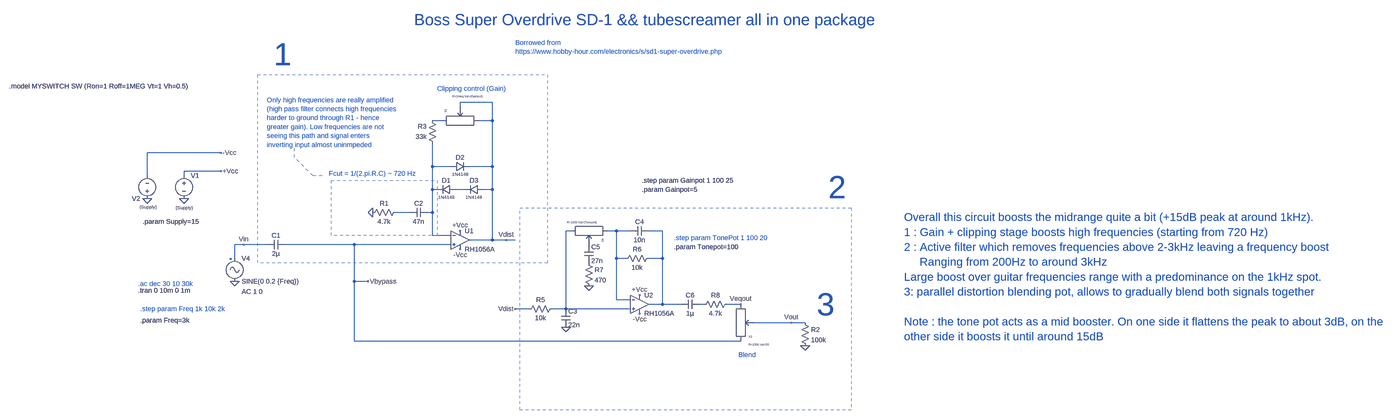
[diagram p0: schematic BossSuperOverdrive-SD-1.asc, whole sheet]
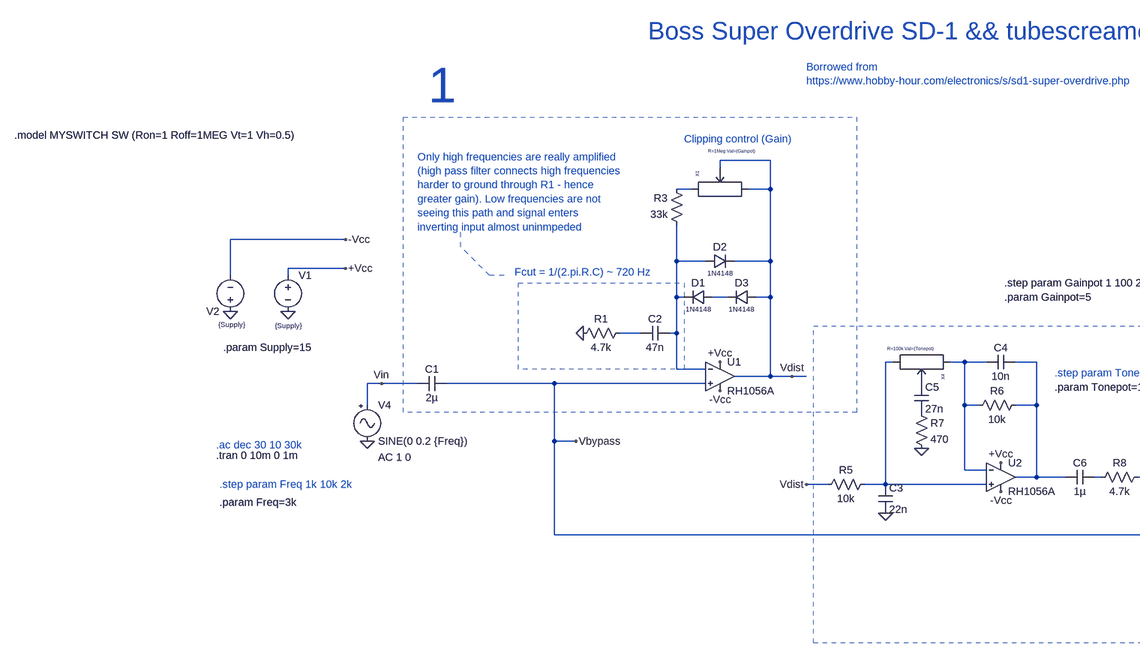
[diagram p1: schematic BossSuperOverdrive-SD-1.asc, part, row 1 of 1, column 1 of 2]
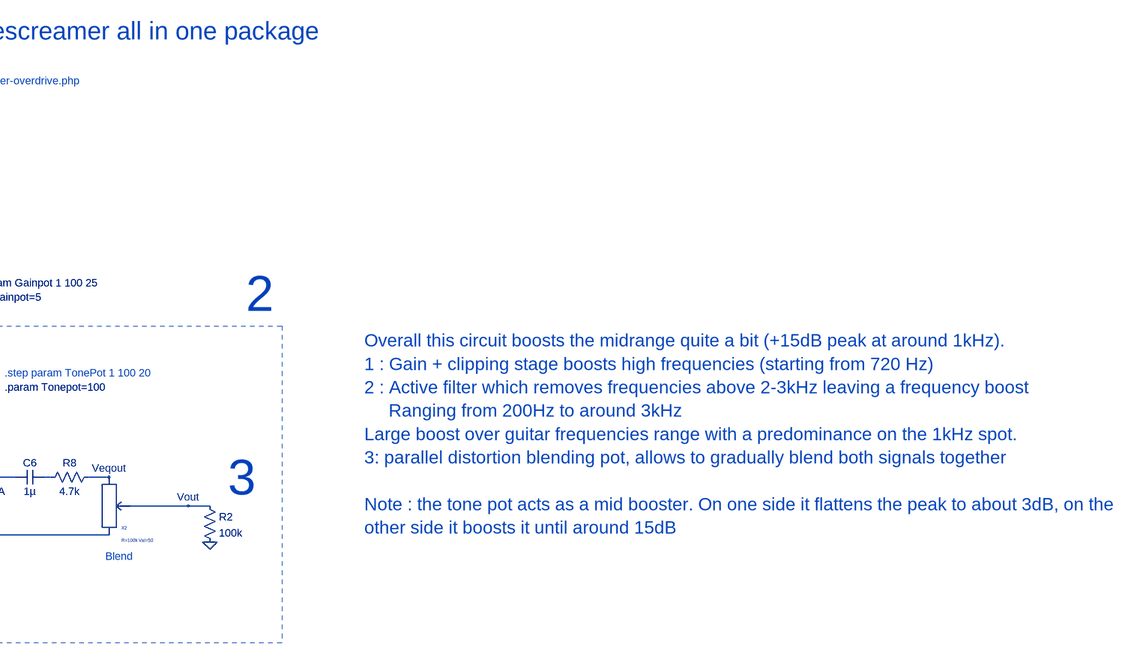
[diagram p2: schematic BossSuperOverdrive-SD-1.asc, part, row 1 of 1, column 2 of 2]
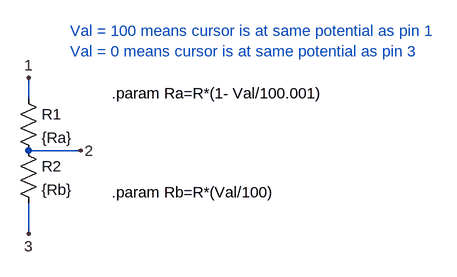
[diagram p3: sub-circuit potentiometer.asc]
BossSuperOverdrive-SD-1.asc, the LTspice schematic file:
Version 4
SHEET 1 4652 756
WIRE 640 -320 528 -320
WIRE 528 -304 528 -320
WIRE 464 -256 432 -256
WIRE 640 -256 640 -320
WIRE 640 -256 592 -256
WIRE -304 -144 -560 -144
WIRE 432 -96 432 -176
WIRE 496 -96 432 -96
WIRE 640 -96 640 -256
WIRE 640 -96 560 -96
WIRE -304 -80 -432 -80
WIRE -560 -64 -560 -144
WIRE -432 -64 -432 -80
WIRE 432 -16 432 -96
WIRE 448 -16 432 -16
WIRE 544 -16 512 -16
WIRE 640 -16 640 -96
WIRE 640 -16 608 -16
WIRE 352 64 304 64
WIRE 432 64 432 -16
WIRE 432 64 416 64
WIRE 912 128 896 128
WIRE 1072 128 1040 128
WIRE 1120 128 1072 128
WIRE 1232 128 1184 128
WIRE 432 144 432 64
WIRE 496 144 432 144
WIRE 640 160 640 -16
WIRE 640 160 560 160
WIRE 688 160 640 160
WIRE 720 160 688 160
WIRE -224 176 -256 176
WIRE -144 176 -224 176
WIRE 160 176 -80 176
WIRE 496 176 160 176
WIRE -256 224 -256 176
WIRE 1072 224 1072 128
WIRE 1104 224 1072 224
WIRE 1232 224 1232 128
WIRE 1232 224 1184 224
WIRE 160 304 160 176
WIRE 208 304 160 304
WIRE 1072 368 1072 224
WIRE 1120 368 1072 368
WIRE 1232 384 1232 224
WIRE 1232 384 1184 384
WIRE 1296 384 1232 384
WIRE 1376 384 1360 384
WIRE 1504 384 1456 384
WIRE 768 400 720 400
WIRE 896 400 896 128
WIRE 896 400 848 400
WIRE 1120 400 896 400
WIRE 1680 448 1552 448
WIRE 1728 448 1680 448
WIRE 160 512 160 304
WIRE 1504 512 160 512
FLAG -560 16 0
FLAG -432 16 0
FLAG -304 -80 +Vcc
FLAG -304 -144 -Vcc
FLAG 528 128 +Vcc
FLAG 528 192 -Vcc
FLAG -256 304 0
FLAG 224 64 0
FLAG 1728 528 0
FLAG -224 176 Vin
FLAG 688 160 Vdist
FLAG 1680 448 Vout
FLAG 208 304 Vbypass
FLAG 896 464 0
FLAG 720 400 Vdist
FLAG 1152 352 +Vcc
FLAG 1152 416 -Vcc
FLAG 976 320 0
FLAG 1504 384 Veqout
SYMBOL cap -80 160 R90
WINDOW 0 0 32 VBottom 2
WINDOW 3 32 32 VTop 2
SYMATTR InstName C1
SYMATTR Value 2µ
SYMBOL voltage -432 -80 R0
WINDOW 123 0 0 Left 0
WINDOW 39 0 0 Left 0
WINDOW 3 -29 127 Left 1
SYMATTR Value {Supply}
SYMATTR InstName V1
SYMBOL voltage -560 32 R180
WINDOW 123 0 0 Left 0
WINDOW 39 0 0 Left 0
WINDOW 3 -33 -13 Left 1
SYMATTR Value {Supply}
SYMATTR InstName V2
SYMBOL diode 512 -32 R90
WINDOW 0 0 32 VBottom 2
WINDOW 3 32 32 VTop 1
SYMATTR InstName D1
SYMATTR Value 1N4148
SYMBOL diode 496 -80 R270
WINDOW 0 32 32 VTop 2
WINDOW 3 0 32 VBottom 1
SYMATTR InstName D2
SYMATTR Value 1N4148
SYMBOL Misc\\signal -256 208 R0
WINDOW 123 24 132 Left 2
WINDOW 39 0 0 Left 0
SYMATTR Value2 AC 1 0
SYMATTR InstName V4
SYMATTR Value SINE(0 0.2 {Freq})
SYMBOL OpAmps\\RH1056A 528 96 R0
SYMATTR InstName U1
SYMBOL diode 608 -32 R90
WINDOW 0 0 32 VBottom 2
WINDOW 3 32 32 VTop 1
SYMATTR InstName D3
SYMATTR Value 1N4148
SYMBOL res 320 48 R90
WINDOW 0 0 56 VBottom 2
WINDOW 3 32 56 VTop 2
SYMATTR InstName R1
SYMATTR Value 4.7k
SYMBOL res 1712 432 R0
SYMATTR InstName R2
SYMATTR Value 100k
SYMBOL res 448 -160 R180
WINDOW 0 36 76 Left 2
WINDOW 3 36 40 Left 2
SYMATTR InstName R3
SYMATTR Value 33k
SYMBOL cap 416 48 R90
WINDOW 0 0 32 VBottom 2
WINDOW 3 32 32 VTop 2
SYMATTR InstName C2
SYMATTR Value 47n
SYMBOL Potentiometer 528 -256 R270
WINDOW 39 84 -26 VRight 0
SYMATTR SpiceLine R=1Meg Val={Gainpot}
SYMATTR InstName X1
SYMBOL Potentiometer 1504 448 M180
WINDOW 39 28 -77 Left 0
SYMATTR SpiceLine R=100k Val=50
SYMATTR InstName X2
SYMBOL res 864 384 R90
WINDOW 0 0 56 VBottom 2
WINDOW 3 32 56 VTop 2
SYMATTR InstName R5
SYMATTR Value 10k
SYMBOL cap 880 400 R0
SYMATTR InstName C3
SYMATTR Value 22n
SYMBOL OpAmps\\RH1056A 1152 320 R0
SYMATTR InstName U2
SYMBOL res 1200 208 R90
WINDOW 0 0 56 VBottom 2
WINDOW 3 32 56 VTop 2
SYMATTR InstName R6
SYMATTR Value 10k
SYMBOL cap 1184 112 R90
WINDOW 0 0 32 VBottom 2
WINDOW 3 32 32 VTop 2
SYMATTR InstName C4
SYMATTR Value 10n
SYMBOL Potentiometer 976 128 R90
WINDOW 39 -29 -26 VRight 0
SYMATTR SpiceLine R=100k Val={Tonepot}
SYMATTR InstName X4
SYMBOL cap 960 176 R0
SYMATTR InstName C5
SYMATTR Value 27n
SYMBOL res 960 224 R0
SYMATTR InstName R7
SYMATTR Value 470
SYMBOL cap 1360 368 R90
WINDOW 0 0 32 VBottom 2
WINDOW 3 32 32 VTop 2
SYMATTR InstName C6
SYMATTR Value 1µ
SYMBOL res 1472 368 R90
WINDOW 0 0 56 VBottom 2
WINDOW 3 32 56 VTop 2
SYMATTR InstName R8
SYMATTR Value 4.7k
TEXT -592 336 Left 2 !.tran 0 10m 0 1m
TEXT -1040 -376 Left 2 !.model MYSWITCH SW (Ron=1 Roff=1MEG Vt=1 Vh=0.5)
TEXT -576 96 Left 2 !.param Supply=15
TEXT 1160 -48 Left 2 !.step param Gainpot 1 100 25
TEXT 1160 -16 Left 2 !.param Gainpot=5
TEXT 1496 560 Left 2 ;Blend
TEXT 448 -368 Left 2 ;Clipping control (Gain)
TEXT -584 400 Left 2 ;.step param Freq 1k 10k 2k
TEXT -584 440 Left 2 !.param Freq=3k
TEXT 720 -528 Left 2 ;Borrowed from \nhttps://www.hobby-hour.com/electronics/s/sd1-super-overdrive.php
TEXT 368 -608 Left 5 ;Boss Super Overdrive SD-1 && tubescreamer all in one package
TEXT -144 -328 Left 2 ;Only high frequencies are really amplified \n(high pass filter connects high frequencies\nharder to ground through R1 - hence \ngreater gain). Low frequencies are not\nseeing this path and signal enters \ninverting input almost uninmpeded
TEXT 72 -72 Left 2 ;Fcut = 1/(2.pi.R.C) ~ 720 Hz
TEXT -592 312 Left 2 ;.ac dec 30 10 30k
TEXT 1272 152 Left 2 ;.step param TonePot 1 100 20
TEXT 1272 184 Left 2 !.param Tonepot=100
TEXT -120 -488 Left 7 ;1
TEXT 1808 -24 Left 7 ;2
TEXT 2232 80 Left 4 ;Overall this circuit boosts the midrange quite a bit (+15dB peak at around 1kHz).\n1 : Gain + clipping stage boosts high frequencies (starting from 720 Hz)\n2 : Active filter which removes frequencies above 2-3kHz leaving a frequency boost \n     Ranging from 200Hz to around 3kHz\nLarge boost over guitar frequencies range with a predominance on the 1kHz spot.\n3: parallel distortion blending pot, allows to gradually blend both signals together\n \nNote : the tone pot acts as a mid booster. On one side it flattens the peak to about 3dB, on the \nother side it boosts it until around 15dB
TEXT 1768 384 Left 7 ;3
LINE Normal 192 -64 192 -64 2
LINE Normal 192 -64 192 -64 2
LINE Normal -48 -128 -48 -160 2
LINE Normal -32 -112 -48 -128 2
LINE Normal 16 -64 -32 -112 2
LINE Normal 48 -64 16 -64 2
LINE Normal 48 -64 48 -64 2
RECTANGLE Normal 448 144 80 -48 2
RECTANGLE Normal 832 240 -176 -416 2
RECTANGLE Normal 1888 752 736 48 2

potentiometer.asc, the sub-circuit schematic file:
Version 4
SHEET 1 908 680
WIRE 192 96 192 64
WIRE 272 176 192 176
WIRE 192 304 192 256
FLAG 192 64 1
FLAG 272 176 2
FLAG 192 304 3
SYMBOL res 176 80 R0
SYMATTR InstName R1
SYMATTR Value {Ra}
SYMBOL res 176 160 R0
SYMATTR InstName R2
SYMATTR Value {Rb}
TEXT 320 88 Left 2 !.param Ra=R*(1- Val/100.001)
TEXT 320 240 Left 2 !.param Rb=R*(Val/100)
TEXT 256 -8 Left 2 ;Val = 100 means cursor is at same potential as pin 1\nVal = 0 means cursor is at same potential as pin 3

The netlist it stands for:
* BossSuperOverdrive-SD-1.asc
C1 Vbypass Vin 2µ
V1 +Vcc 0 {Supply}
V2 0 -Vcc {Supply}
D1 N003 N002 1N4148
D2 N002 Vdist 1N4148
V4 Vin 0 SINE(0 0.2 {Freq}) AC 1 0
XU1 Vbypass N002 +Vcc -Vcc Vdist RH1056A  ; pins In+ In- V+ V- OUT
D3 Vdist N003 1N4148
R1 N004 0 4.7k
R2 Vout 0 100k
R3 N002 N001 33k
C2 N002 N004 47n
XX1 N001 Vdist Vdist potentiometer params: R=1Meg Val={Gainpot}
XX2 Vbypass Vout Veqout potentiometer params: R=100k Val=50
R5 N005 Vdist 10k
C3 N005 0 22n
XU2 N005 N006 +Vcc -Vcc N007 RH1056A  ; pins In+ In- V+ V- OUT
R6 N007 N006 10k
C4 N007 N006 10n
XX4 N006 P001 N005 potentiometer params: R=100k Val={Tonepot}
C5 P001 P002 27n
R7 P002 0 470
C6 N008 N007 1µ
R8 Veqout N008 4.7k

* block symbol definitions
.subckt potentiometer 1 2 3
R1 1 2 {Ra}
R2 2 3 {Rb}
.param Ra=R*(1- Val/100.001)
.param Rb=R*(Val/100)
* Val = 100 means cursor is at same potential as pin 1
* Val = 0 means cursor is at same potential as pin 3
.ends potentiometer

.model D D
.lib standard.dio
.tran 0 10m 0 1m
.model MYSWITCH SW (Ron=1 Roff=1MEG Vt=1 Vh=0.5)
.param Supply=15
.step param Gainpot 1 100 25
.param Gainpot=5
* Blend
* Clipping control (Gain)
* .step param Freq 1k 10k 2k
.param Freq=3k
* Borrowed from
* https://www.hobby-hour.com/electronics/s/sd1-super-overdrive.php
* Boss Super Overdrive SD-1 && tubescreamer all in one package
* Only high frequencies are really amplified
* (high pass filter connects high frequencies
* harder to ground through R1 - hence
* greater gain). Low frequencies are not
* seeing this path and signal enters
* inverting input almost uninmpeded
* Fcut = 1/(2.pi.R.C) ~ 720 Hz
* .ac dec 30 10 30k
* .step param TonePot 1 100 20
.param Tonepot=100
* 1
* 2
* Overall this circuit boosts the midrange quite a bit (+15dB peak at around 1kHz).
* 1 : Gain + clipping stage boosts high frequencies (starting from 720 Hz)
* 2 : Active filter which removes frequencies above 2-3kHz leaving a frequency boost
*      Ranging from 200Hz to around 3kHz
* Large boost over guitar frequencies range with a predominance on the 1kHz spot.
* 3: parallel distortion blending pot, allows to gradually blend both signals together
* Note : the tone pot acts as a mid booster. On one side it flattens the peak to about 3dB, on the
* other side it boosts it until around 15dB
* 3
.backanno
.end